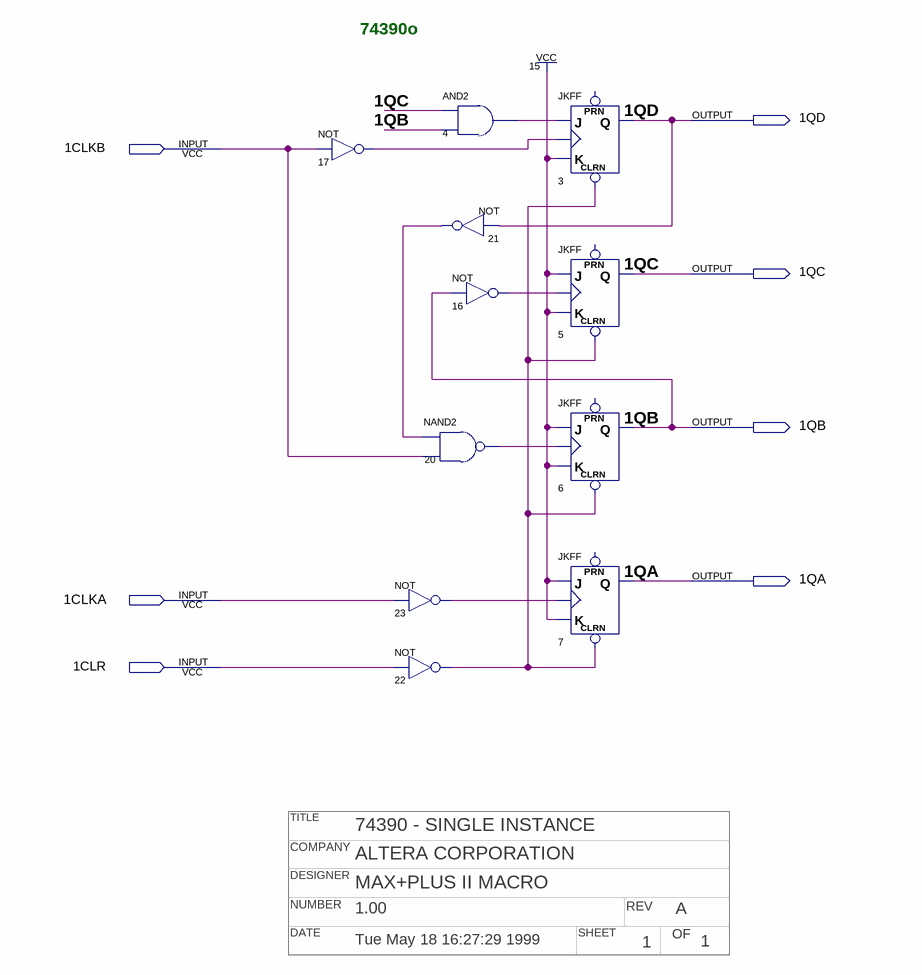
[diagram p0: schematic sheet]
// Quartus schematic 74390o.bdf as structural Verilog: 11 symbols, 7 pins
// Title block: TITLE: 74390 - SINGLE INSTANCE; COMPANY: ALTERA CORPORATION; DESIGNER: MAX+PLUS II MACRO; NUMBER: 1.00; REV: A; DATE: Tue May 18 16:27:29 1999; SHEET: 1; OF: 1
module \74390o  (
  input  \1CLKB ,
  input  \1CLKA ,
  input  \1CLR ,
  output \1QD ,
  output \1QC ,
  output \1QB ,
  output \1QA 
);

  wire n4_out, n16_out, n17_out, n20_out, n21_out, n22_out, n23_out;

  not u_17 (n17_out, \1CLKB );
  and u_4 (n4_out, \1QC , \1QB );
  not u_21 (n21_out, \1QD );
  not u_16 (n16_out, \1QB );
  nand u_20 (n20_out, n21_out, \1CLKB );
  not u_23 (n23_out, \1CLKA );
  not u_22 (n22_out, \1CLR );
  JKFF u_3 (.CLRN(n22_out), .K(1'b1), .J(n4_out), .CLK(n17_out), .Q(\1QD ));  // open: PRN
  JKFF u_5 (.CLRN(n22_out), .K(1'b1), .J(1'b1), .CLK(n16_out), .Q(\1QC ));  // open: PRN
  JKFF u_6 (.CLRN(n22_out), .K(1'b1), .J(1'b1), .CLK(n20_out), .Q(\1QB ));  // open: PRN
  JKFF u_7 (.CLRN(n22_out), .K(1'b1), .J(1'b1), .CLK(n23_out), .Q(\1QA ));  // open: PRN

  // Notes on the sheet:
  //   74390o
endmodule
